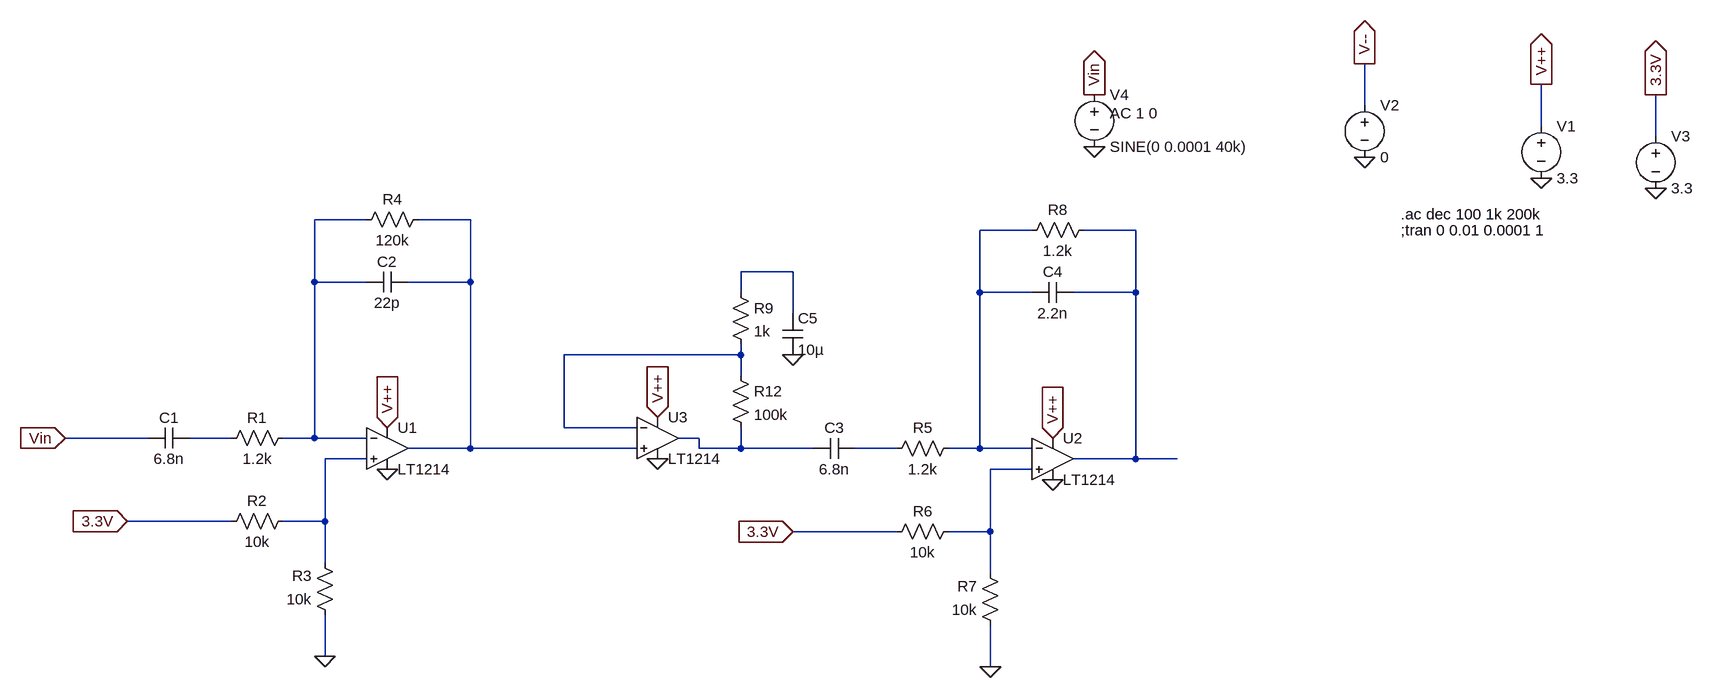
[diagram p0: schematic Receiver_Circuit.asc]
Receiver_Circuit.asc, the LTspice schematic file:
Version 4
SHEET 1 1928 680
WIRE 1408 -384 1408 -448
WIRE 1680 -352 1680 -416
WIRE 1856 -336 1856 -400
WIRE -128 -208 -208 -208
WIRE 32 -208 -48 -208
WIRE 896 -192 816 -192
WIRE 1056 -192 976 -192
WIRE 528 -128 448 -128
WIRE -208 -112 -208 -208
WIRE -128 -112 -208 -112
WIRE 32 -112 32 -208
WIRE 32 -112 -64 -112
WIRE 448 -96 448 -128
WIRE 816 -96 816 -192
WIRE 896 -96 816 -96
WIRE 1056 -96 1056 -192
WIRE 1056 -96 960 -96
WIRE 528 -64 528 -128
WIRE 448 0 448 -16
WIRE 448 0 176 0
WIRE 448 32 448 0
WIRE 176 112 176 0
WIRE 288 112 176 112
WIRE -464 128 -592 128
WIRE -336 128 -400 128
WIRE -208 128 -208 -112
WIRE -208 128 -256 128
WIRE -128 128 -208 128
WIRE 384 128 352 128
WIRE 32 144 32 -112
WIRE 32 144 -64 144
WIRE 288 144 32 144
WIRE 384 144 384 128
WIRE 448 144 448 112
WIRE 448 144 384 144
WIRE 560 144 448 144
WIRE 688 144 624 144
WIRE 816 144 816 -96
WIRE 816 144 768 144
WIRE 896 144 816 144
WIRE -128 160 -192 160
WIRE 1056 160 1056 -96
WIRE 1056 160 960 160
WIRE 1120 160 1056 160
WIRE 896 176 832 176
WIRE -336 256 -496 256
WIRE -192 256 -192 160
WIRE -192 256 -256 256
WIRE 688 272 528 272
WIRE 832 272 832 176
WIRE 832 272 768 272
WIRE -192 320 -192 256
WIRE 832 336 832 272
WIRE -192 464 -192 400
WIRE 832 480 832 416
FLAG -192 464 0
FLAG -96 112 V++
IOPIN -96 112 In
FLAG 832 480 0
FLAG 928 128 V++
IOPIN 928 128 In
FLAG 528 272 3.3V
IOPIN 528 272 In
FLAG -496 256 3.3V
IOPIN -496 256 In
FLAG -96 176 0
FLAG 928 192 0
FLAG -592 128 Vin
IOPIN -592 128 In
FLAG 320 96 V++
IOPIN 320 96 In
FLAG 320 160 0
FLAG 528 0 0
FLAG 1680 -272 0
FLAG 1408 -304 0
FLAG 1680 -416 V++
IOPIN 1680 -416 Out
FLAG 1408 -448 V--
IOPIN 1408 -448 Out
FLAG 992 -320 0
FLAG 992 -400 Vin
IOPIN 992 -400 Out
FLAG 1856 -256 0
FLAG 1856 -400 3.3V
IOPIN 1856 -400 Out
SYMBOL cap -400 112 R90
WINDOW 0 0 32 VBottom 2
WINDOW 3 32 32 VTop 2
SYMATTR InstName C1
SYMATTR Value 6.8n
SYMBOL res -240 112 R90
WINDOW 0 0 56 VBottom 2
WINDOW 3 32 56 VTop 2
SYMATTR InstName R1
SYMATTR Value 1.2k
SYMBOL res -240 240 R90
WINDOW 0 0 56 VBottom 2
WINDOW 3 32 56 VTop 2
SYMATTR InstName R2
SYMATTR Value 10k
SYMBOL res -176 416 R180
WINDOW 0 36 76 Left 2
WINDOW 3 36 40 Left 2
SYMATTR InstName R3
SYMATTR Value 10k
SYMBOL res -32 -224 R90
WINDOW 0 0 56 VBottom 2
WINDOW 3 32 56 VTop 2
SYMATTR InstName R4
SYMATTR Value 120k
SYMBOL cap -64 -128 R90
WINDOW 0 0 32 VBottom 2
WINDOW 3 32 32 VTop 2
SYMATTR InstName C2
SYMATTR Value 22p
SYMBOL cap 624 128 R90
WINDOW 0 0 32 VBottom 2
WINDOW 3 32 32 VTop 2
SYMATTR InstName C3
SYMATTR Value 6.8n
SYMBOL res 784 128 R90
WINDOW 0 0 56 VBottom 2
WINDOW 3 32 56 VTop 2
SYMATTR InstName R5
SYMATTR Value 1.2k
SYMBOL res 784 256 R90
WINDOW 0 0 56 VBottom 2
WINDOW 3 32 56 VTop 2
SYMATTR InstName R6
SYMATTR Value 10k
SYMBOL res 848 432 R180
WINDOW 0 36 76 Left 2
WINDOW 3 36 40 Left 2
SYMATTR InstName R7
SYMATTR Value 10k
SYMBOL res 992 -208 R90
WINDOW 0 0 56 VBottom 2
WINDOW 3 32 56 VTop 2
SYMATTR InstName R8
SYMATTR Value 1.2k
SYMBOL cap 960 -112 R90
WINDOW 0 0 32 VBottom 2
WINDOW 3 32 32 VTop 2
SYMATTR InstName C4
SYMATTR Value 2.2n
SYMBOL Opamps\\LT1214 -96 80 R0
SYMATTR InstName U1
SYMBOL Opamps\\LT1214 928 96 R0
SYMATTR InstName U2
SYMBOL Opamps\\LT1214 320 64 R0
SYMATTR InstName U3
SYMBOL res 432 -112 R0
SYMATTR InstName R9
SYMATTR Value 1k
SYMBOL cap 512 -64 R0
SYMATTR InstName C5
SYMATTR Value 10µ
SYMBOL res 432 16 R0
SYMATTR InstName R12
SYMATTR Value 100k
SYMBOL voltage 1680 -368 R0
WINDOW 123 0 0 Left 0
WINDOW 39 0 0 Left 0
SYMATTR InstName V1
SYMATTR Value 3.3
SYMBOL voltage 1408 -400 R0
WINDOW 123 0 0 Left 0
WINDOW 39 0 0 Left 0
SYMATTR InstName V2
SYMATTR Value 0
SYMBOL voltage 1856 -352 R0
WINDOW 123 0 0 Left 0
WINDOW 39 0 0 Left 0
SYMATTR InstName V3
SYMATTR Value 3.3
SYMBOL voltage 992 -416 R0
WINDOW 123 24 44 Left 2
WINDOW 39 0 0 Left 0
SYMATTR Value2 AC 1 0
SYMATTR InstName V4
SYMATTR Value SINE(0 0.0001 40k)
TEXT 1464 -216 Left 2 !.ac dec 100 1k 200k
TEXT 1464 -192 Left 2 !;tran 0 0.01 0.0001 1

The netlist it stands for:
* Receiver_Circuit.asc
C1 N007 Vin 6.8n
R1 N001 N007 1.2k
R2 N010 3.3V 10k
R3 0 N010 10k
R4 N002 N001 120k
C2 N002 N001 22p
C3 N009 N008 6.8n
R5 N003 N009 1.2k
R6 N011 3.3V 10k
R7 0 N011 10k
R8 N004 N003 1.2k
C4 N004 N003 2.2n
XU1 N010 N001 V++ 0 N002 LT1213  ; LT1214, pins In+ In- V+ V- OUT
XU2 N011 N003 V++ 0 N004 LT1213  ; LT1214, pins In+ In- V+ V- OUT
XU3 N002 N006 V++ 0 N008 LT1213  ; LT1214, pins In+ In- V+ V- OUT
R9 N005 N006 1k
C5 N005 0 10µ
R12 N006 N008 100k
V1 V++ 0 3.3
V2 V-- 0 0
V3 3.3V 0 3.3
V4 Vin 0 SINE(0 0.0001 40k) AC 1 0
.ac dec 100 1k 200k
;tran 0 0.01 0.0001 1
.lib LTC.lib
.backanno
.end